# Altium schematic sheet esp32Pinout.SchDoc
size A4; SheetNumber: 2; SheetTotal: 5
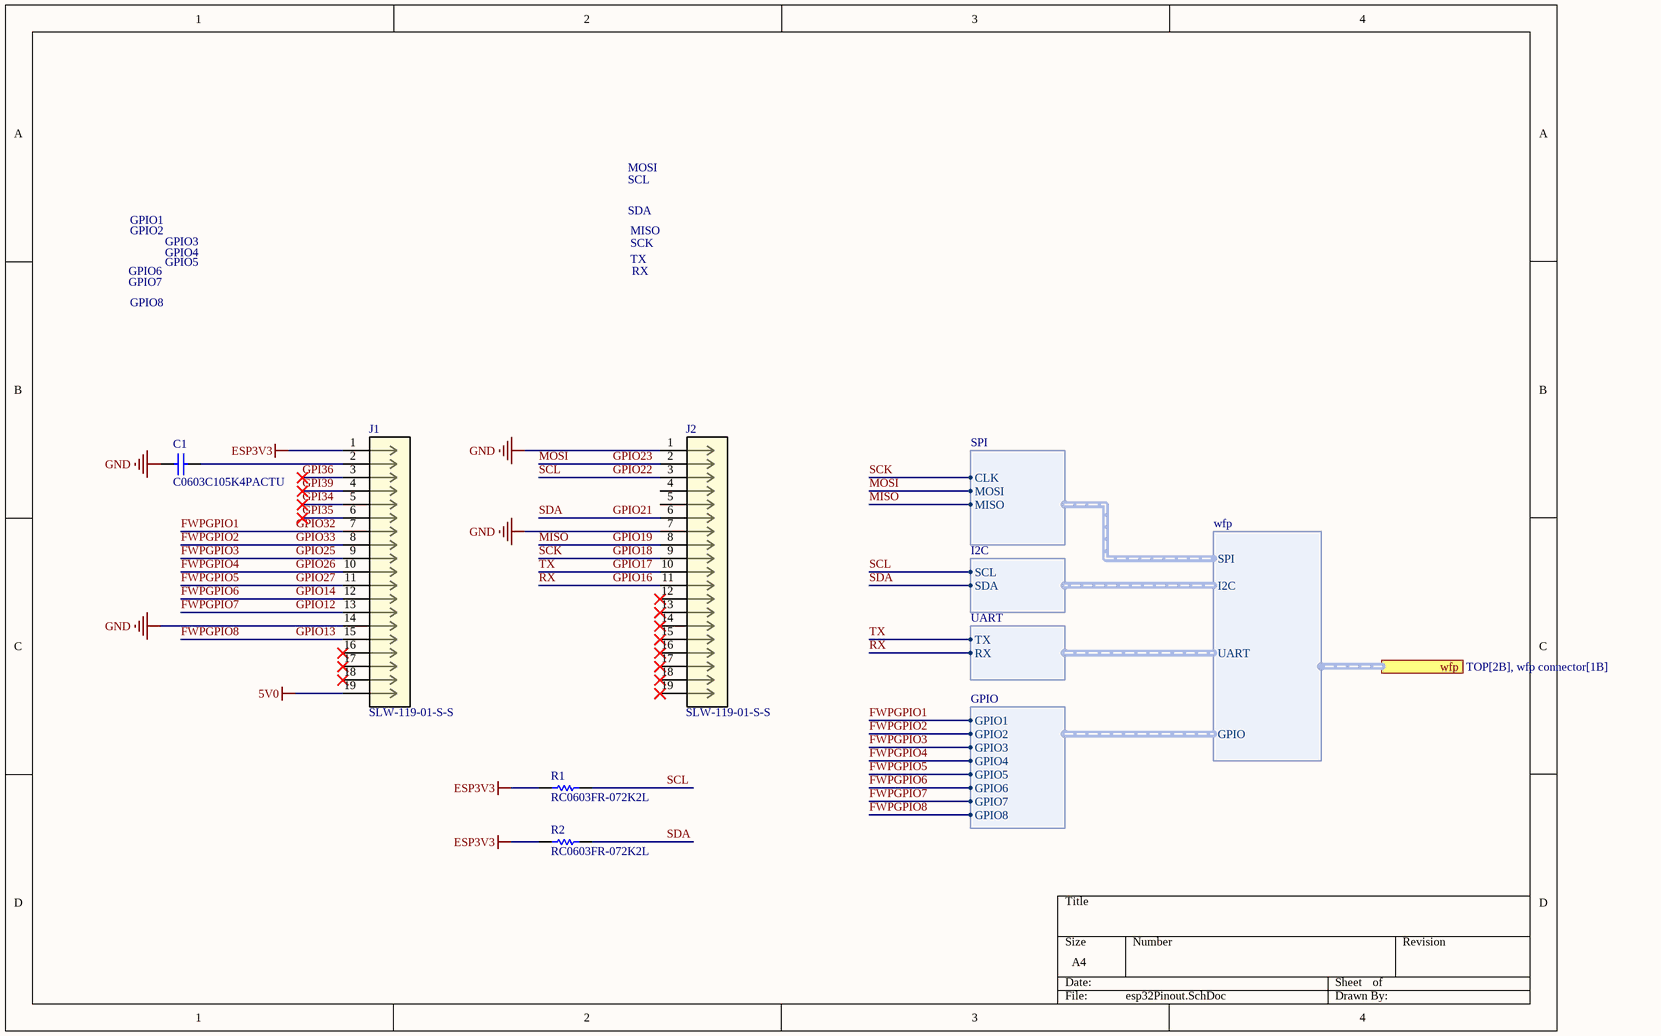
[diagram p0: esp32Pinout.SchDoc]

## Parts
C1  C0603C105K4PACTU  [CAPC1608X90X35NL15T15]
J1  SLW-119-01-S-S  [CON19_1X19_TU_SLW_SAI]
J2  SLW-119-01-S-S  [CON19_1X19_TU_SLW_SAI]
R1  RC0603FR-072K2L  [RESC1608X55X25LL10T15]
R2  RC0603FR-072K2L  [RESC1608X55X25LL10T15]

## Ports
wfp (harness wfp, see TOP[2B], wfp connector[1B])

## Harnesses
wfp: SPI, I2C, GPIO, UART
SPI: CLK, MOSI, MISO
I2C: SCL, SDA
UART: TX, RX
GPIO: GPIO1, GPIO2, GPIO3, GPIO4, GPIO5, GPIO6, GPIO7, GPIO8

## Nets
5V0: J1.19
ESP3V3: J1.1 R1.1 R2.1
GND: C1.1 J1.14 J2.1 J2.7
FWPGPIO1: J1.7 ; harness GPIO.GPIO1  [also labelled GPIO32]
FWPGPIO2: J1.8 ; harness GPIO.GPIO2  [also labelled GPIO33]
FWPGPIO3: J1.9 ; harness GPIO.GPIO3  [also labelled GPIO25]
FWPGPIO4: J1.10 ; harness GPIO.GPIO4  [also labelled GPIO26]
FWPGPIO5: J1.11 ; harness GPIO.GPIO5  [also labelled GPIO27]
FWPGPIO6: J1.12 ; harness GPIO.GPIO6  [also labelled GPIO14]
FWPGPIO7: J1.13 ; harness GPIO.GPIO7  [also labelled GPIO12]
FWPGPIO8: J1.15 ; harness GPIO.GPIO8  [also labelled GPIO13]
GPI34: J1.5
GPI35: J1.6
GPI36: J1.3
GPI39: J1.4
GPIO16: J2.11 ; harness UART.RX  [also labelled RX]
GPIO17: J2.10 ; harness UART.TX  [also labelled TX]
GPIO18: J2.9 ; harness SPI.CLK  [also labelled SCK]
GPIO19: J2.8 ; harness SPI.MISO  [also labelled MISO]
GPIO21: J2.6 R2.2 ; harness I2C.SDA  [also labelled SDA]
GPIO22: J2.3 R1.2 ; harness I2C.SCL  [also labelled SCL]
GPIO23: J2.2 ; harness SPI.MOSI  [also labelled MOSI]
NetC1_2: C1.2 J1.2

Not connected (* = marked no-connect by the designer): J1 16* 17* 18*; J2 4 5 12* 13* 14* 15* 16* 17* 18* 19*

## Notes on the sheet
- MOSI
- GPIO1
- GPIO2
- GPIO3
- SCL
- SDA
- MISO
- SCK
- GPIO6
- GPIO7
- GPIO8
- GPIO4
- GPIO5
- TX
- RX

## Library data of the parts
C1 = CMP-2006-02239-1: Manufacturer: Kemet; Part Number: C0603C105K4PACTU
J1 J2 = SLW-119-01-S-S: No Description Available; Mfr_Name: Samtec Inc; RefDes: RefDes; Type: Type
R1 R2 = CMP-2000-06934-1: Thick Film Resistor, 2.2 KOhm, 100 mW, 50 V, +/- 1%, -55 to 155 degC, 2-Pin SMD (0603), RoHS, Tape and Reel; Manufacturer: Yageo; Resistance: 2.2kOhms; Temperature Coefficient: 100PPM/C; Voltage Rating: 50V; Power Rating: 100mW; Tolerance: 1%; Datasheet Version: Rev. 7, 05/2017; Case Code - mm: 1608; Series: RC; Mounting Technology: SurfaceMount; Package Description: 2-Pin Surface Mount Device, Body 1.6 x 0.8 mm; Case Code - in: 0603; Package Reference: 0603; Product: ThickFilmResistorsGeneralPurpose; Manufacturer URL: http://www.yageo.com/; Termination Style: SMD/SMT; Operating Temperature Range: -55Cto+155C; Datasheet URL: http://www.yageo.com/documents/recent/PYu-RC_Group_51_RoHS_L_7.pdf; Packaging: Reel